# Altium project Motherboard.PrjPcb (part 2 of 2)

## Sheet PT_Connetions.SchDoc
size Letter
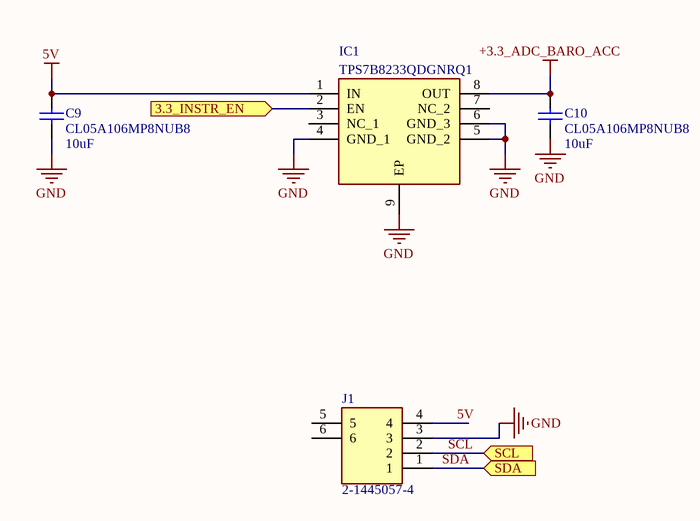
[diagram p8: PT_Connetions.SchDoc]

### Parts
C9  CL05A106MP8NUB8  value 10uF  [0402]
C10  CL05A106MP8NUB8  value 10uF  [0402]
IC1  TPS7B8233QDGNRQ1  [SOP65P490X110-9N]
J1  2-1445057-4  [214450574]

### Ports
3.3_INSTR_EN (in), SCL (in), SDA (in)

### Nets
5V: C9.2 IC1.1(IN) J1.4
+3.3_ADC_BARO_ACC: C10.2 IC1.8(OUT)
GND: C9.1 C10.1 IC1.4(GND_1) IC1.5(GND_2) IC1.6(GND_3) IC1.9(EP) J1.3
GPIO13: IC1.2(EN) ; port 3.3_INSTR_EN
SCL: J1.2 ; port SCL
SDA: J1.1 ; port SDA

Not connected (* = marked no-connect by the designer): IC1 3(NC_1) 7(NC_2); J1 5 6

### Notes on the sheet
- Title
- Size:
- Date:
- Letter
- Number:
- Time:
- Revision:
- Sheet
- of
- Rocket Propulsion Laboratory
- UC San Diego
- Avionics Team
- Author :
- File:

### Library data of the parts
C9 C10 = Cap: Capacitor; Published: 8-Jun-2000; LatestRevisionDate: 17-Jul-2002; LatestRevisionNote: Re-released for DXP Platform.; PackageReference: RAD-0.3; Publisher: Altium Limited; PackageDescription: Radial Cap, Thru-Hole; 2 Leads; 0.3 in Pin Spacing
IC1 = TPS7B8233QDGNRQ1: Integrated Circuit; Manufacturer_Name: Texas Instruments; Datasheet Link: http://www.ti.com/lit/gpn/tps7b82-q1; Height: 1.1mm; Manufacturer_Part_Number: TPS7B8233QDGNRQ1; Arrow Part Number: TPS7B8233QDGNRQ1; Arrow Price/Stock: https://www.arrow.com/en/products/tps7b8233qdgnrq1/texas-instruments; Mouser Part Number: 595-TPS7B8233QDGNRQ1; Mouser Price/Stock: https://www.mouser.co.uk/ProductDetail/Texas-Instruments/TPS7B8233QDGNRQ1?qs=gTYE2QTfZfTgserf%2FHg6KA%3D%3D
J1 = 2-1445057-4: Connector; Manufacturer_Name: TE Connectivity; Datasheet Link: http://www.te.com/commerce/DocumentDelivery/DDEController?Action=showdoc&DocId=Customer+Drawing%7F1445057%7FC3%7Fpdf%7FEnglish%7FENG_CD_1445057_C3.pdf%7F2-1445057-4; Height: 3mm; Manufacturer_Part_Number: 2-1445057-4; Arrow Part Number: 2-1445057-4; Arrow Price/Stock: https://www.arrow.com/en/products/2-1445057-4/te-connectivity; Mouser Part Number: 571-2-1445057-4; Mouser Price/Stock: https://www.mouser.co.uk/ProductDetail/TE-Connectivity-AMP/2-1445057-4?qs=MP5IOa7hLjUITJfr001xww%3D%3D

## Nets that join several sheets
1.8V: Top (5 pins), Power (7 pins)
3.3V: Top (14 pins), Power (9 pins)
5V: Top (J8.2), MAX14830ETM+ (C11.2 IC10.1), Cell_SARA-G350-02S (C14.2 IC4.1), GPS_MAX-M8C-0-10 (C22.2 DS1.1 IC8.1), Power (D9.1 F1.2 L3.1 U5.5), PT_Connetions (C9.2 IC1.1 J1.4)
5V_COMPUTE: Top (J6.197 J6.198 J6.199 J6.200), Power (9 pins)
5V_PDB: Top (P4.13 P4.14), Power (DS2.1 F1.1 Q2.3 U5.1)
+3.3_ADC_BARO_ACC: Accelerometers (22 pins), Barometer (5 pins), PT_Connetions (C10.2 IC1.8)
+3.3_GPS: Cell_SARA-G350-02S (IC5.1 IC6.5), GPS_MAX-M8C-0-10 (12 pins)
+3.3_MAX3488_MAX14830: MAX14830ETM+ (10 pins), MAX3488AEGSA+ (C28.2 IC9.1)
CGND: Top (D10.2 D11.3 D12.2 D13.3), MAX14830ETM+ (D7.2 D8.2), Cell_SARA-G350-02S (D1.2 D2.2 D3.2 D4.2), Power (6 pins)
GND: Top (72 pins), Accelerometers (24 pins), Barometer (5 pins), MAX14830ETM+ (11 pins), Cell_SARA-G350-02S (67 pins), MAX3488AEGSA+ (C28.1 IC9.4), GPS_MAX-M8C-0-10 (20 pins), Power (26 pins), PT_Connetions (7 pins)
3.3_COMMS_EN: Top (J6.59), MAX14830ETM+ (IC10.2)
3.3_GPS_EN: Top (J6.57), GPS_MAX-M8C-0-10 (IC8.2)
3.8_SARA_EN: Top (J6.48), Cell_SARA-G350-02S (IC4.3)
CHIP_SELECT: Top (J6.58), MAX14830ETM+ (U4.5)
GPIO13: Top (J6.47), PT_Connetions (IC1.2)
GPS_SCL: Cell_SARA-G350-02S (IC7.27 R4.1), GPS_MAX-M8C-0-10 (U3.17)
GPS_SDA: Cell_SARA-G350-02S (IC7.26 R5.1), GPS_MAX-M8C-0-10 (U3.16)
MISO: Top (D11.1 J6.60 J8.6), MAX14830ETM+ (U4.3)
MOSI: Top (D11.2 J6.64 J8.8), MAX14830ETM+ (U4.6)
RX_CB: MAX14830ETM+ (U4.41), MAX3488AEGSA+ (IC9.2)
RX_CELL: MAX14830ETM+ (U4.17), Cell_SARA-G350-02S (IC6.4)
RX_GPS: MAX14830ETM+ (U4.25), GPS_MAX-M8C-0-10 (U3.2)
SCL: Top (D13.2 J6.5 P4.19 R26.2), Accelerometers (U1.2 U2.2), Barometer (IC3.2), PT_Connetions (J1.2)
SCLK: Top (D10.1 J6.66 J8.10), MAX14830ETM+ (U4.4)
SDA: Top (D13.1 J6.3 P4.20 R25.2), Accelerometers (U1.4 U2.4), Barometer (IC3.4), PT_Connetions (J1.1)
TX_CB: MAX14830ETM+ (U4.42), MAX3488AEGSA+ (IC9.3)
TX_CELL: MAX14830ETM+ (U4.18), Cell_SARA-G350-02S (IC5.2)
TX_GPS: MAX14830ETM+ (U4.26), GPS_MAX-M8C-0-10 (U3.3)
USB_DM: Top (J6.167), Power (D5.2 J5.2)
USB_DP: Top (J6.165), Power (D5.3 J5.3)